# Altium schematic sheet XMOD_Frontpanel.SchDoc
size A4
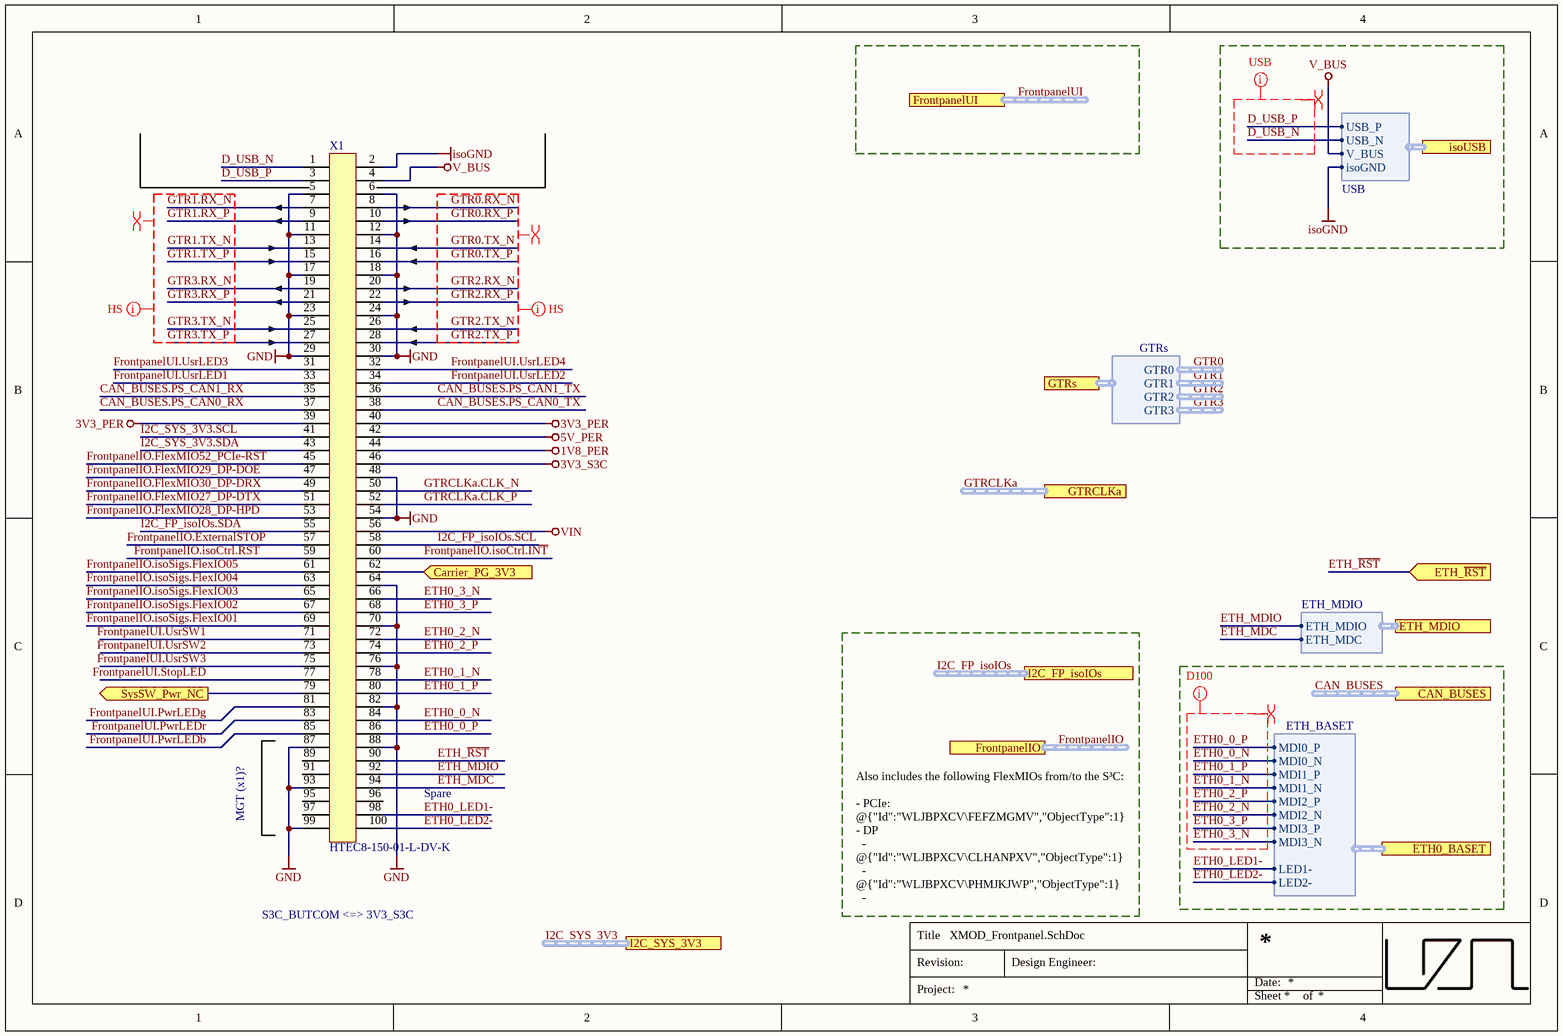
[diagram p0: XMOD_Frontpanel.SchDoc]

## Parts
X1  HTEC8-150-01-L-DV-K  [HTEC8-150-XX-X-DV]

## Ports
CAN_BUSES (harness CAN_BUSES), Carrier_PG_3V3 (in), ETH0_BASET (harness ETH_BASET), ETH_MDIO (harness ETH_MDIO), ETH_~{RST} (in), FrontpanelIO (harness FrontpanelIO), FrontpanelUI (harness FrontpanelUI), GTRCLKa (harness MGTCLK), GTRs (harness GTRs), I2C_FP_isoIOs (harness I2C), I2C_SYS_3V3 (harness I2C), isoUSB (harness USB), SysSW_Pwr_NC (out)

## Harnesses
GTRs: GTR0, GTR1, GTR2, GTR3
ETH_BASET: MDI0_P, MDI0_N, MDI1_P, MDI1_N, MDI2_P, MDI2_N, MDI3_P, MDI3_N, LED1-, LED2-
ETH_MDIO: ETH_MDC, ETH_MDIO
USB: USB_P, USB_N, V_BUS, isoGND

## Nets
1V8_PER: X1.44
3V3_PER: X1.39 X1.40
3V3_S3C: X1.46
5V_PER: X1.42
GND: X1.5 X1.6 X1.11 X1.12 X1.17 X1.18 X1.23 X1.24 X1.29 X1.30 X1.48 X1.54 X1.64 X1.70 X1.76 X1.82 X1.87 X1.88 X1.93 X1.99
isoGND: X1.2 ; port isoUSB.isoGND
V_BUS: X1.4 ; port isoUSB.V_BUS
VIN: X1.56
CAN_BUSES.PS_CAN0_RX: X1.37
CAN_BUSES.PS_CAN0_TX: X1.38
CAN_BUSES.PS_CAN1_RX: X1.35
CAN_BUSES.PS_CAN1_TX: X1.36
Carrier_PG_3V3: X1.62 ; port Carrier_PG_3V3
D_USB_N: X1.1 ; port isoUSB.USB_N
D_USB_P: X1.3 ; port isoUSB.USB_P
ETH0_0_N: X1.84 ; port ETH0_BASET.MDI0_N
ETH0_0_P: X1.86 ; port ETH0_BASET.MDI0_P
ETH0_1_N: X1.78 ; port ETH0_BASET.MDI1_N
ETH0_1_P: X1.80 ; port ETH0_BASET.MDI1_P
ETH0_2_N: X1.72 ; port ETH0_BASET.MDI2_N
ETH0_2_P: X1.74 ; port ETH0_BASET.MDI2_P
ETH0_3_N: X1.66 ; port ETH0_BASET.MDI3_N
ETH0_3_P: X1.68 ; port ETH0_BASET.MDI3_P
ETH0_LED1-: X1.98 ; port ETH0_BASET.LED1-
ETH0_LED2-: X1.100 ; port ETH0_BASET.LED2-
ETH_MDC: X1.94 ; port ETH_MDIO.ETH_MDC
ETH_MDIO: X1.92 ; port ETH_MDIO.ETH_MDIO
ETH_~{RST}: X1.90 ; port ETH_~{RST}
FrontpanelIO.ExternalSTOP: X1.57
FrontpanelIO.FlexMIO27_DP-DTX: X1.51
FrontpanelIO.FlexMIO28_DP-HPD: X1.53
FrontpanelIO.FlexMIO29_DP-DOE: X1.47
FrontpanelIO.FlexMIO30_DP-DRX: X1.49
FrontpanelIO.FlexMIO52_PCIe-~{RST}: X1.45
FrontpanelIO.isoCtrl.~{INT}: X1.60
FrontpanelIO.isoCtrl.~{RST}: X1.59
FrontpanelIO.isoSigs.FlexIO01: X1.69
FrontpanelIO.isoSigs.FlexIO02: X1.67
FrontpanelIO.isoSigs.FlexIO03: X1.65
FrontpanelIO.isoSigs.FlexIO04: X1.63
FrontpanelIO.isoSigs.FlexIO05: X1.61
FrontpanelUI.PwrLEDb: X1.85
FrontpanelUI.PwrLEDg: X1.81
FrontpanelUI.PwrLEDr: X1.83
FrontpanelUI.StopLED: X1.77
FrontpanelUI.UsrLED1: X1.33
FrontpanelUI.UsrLED2: X1.34
FrontpanelUI.UsrLED3: X1.31
FrontpanelUI.UsrLED4: X1.32
FrontpanelUI.UsrSW1: X1.71
FrontpanelUI.UsrSW2: X1.73
FrontpanelUI.UsrSW3: X1.75
GTR0.RX_N: X1.8
GTR0.RX_P: X1.10
GTR0.TX_N: X1.14
GTR0.TX_P: X1.16
GTR1.RX_N: X1.7
GTR1.RX_P: X1.9
GTR1.TX_N: X1.13
GTR1.TX_P: X1.15
GTR2.RX_N: X1.20
GTR2.RX_P: X1.22
GTR2.TX_N: X1.26
GTR2.TX_P: X1.28
GTR3.RX_N: X1.19
GTR3.RX_P: X1.21
GTR3.TX_N: X1.25
GTR3.TX_P: X1.27
GTRCLKa.CLK_N: X1.50
GTRCLKa.CLK_P: X1.52
I2C_FP_isoIOs.SCL: X1.58
I2C_FP_isoIOs.SDA: X1.55
I2C_SYS_3V3.SCL: X1.41
I2C_SYS_3V3.SDA: X1.43
SysSW_Pwr_NC: X1.79 ; port SysSW_Pwr_NC

Not connected (* = marked no-connect by the designer): X1 89 91 95 96 97

## Buses and harness runs
harness CAN_BUSES = port CAN_BUSES
harness FrontpanelIO = port FrontpanelIO
harness FrontpanelUI = port FrontpanelUI
harness GTRCLKa = port GTRCLKa
harness I2C_FP_isoIOs = port I2C_FP_isoIOs
harness I2C_SYS_3V3 = port I2C_SYS_3V3

## Layout directives
differential pair: D_USB_N, D_USB_P, ETH0_0_N, ETH0_0_P, ETH0_1_N, ETH0_1_P, ETH0_2_N, ETH0_2_P, ETH0_3_N, ETH0_3_P, GTR0.RX_N, GTR0.RX_P, GTR0.TX_N, GTR0.TX_P, GTR1.RX_N, GTR1.RX_P, GTR1.TX_N, GTR1.TX_P, GTR2.RX_N, GTR2.RX_P, GTR2.TX_N, GTR2.TX_P, GTR3.RX_N, GTR3.RX_P, GTR3.TX_N, GTR3.TX_P
net class HS: GTR0.RX_N, GTR0.RX_P, GTR0.TX_N, GTR0.TX_P, GTR1.RX_N, GTR1.RX_P, GTR1.TX_N, GTR1.TX_P, GTR2.RX_N, GTR2.RX_P, GTR2.TX_N, GTR2.TX_P, GTR3.RX_N, GTR3.RX_P, GTR3.TX_N, GTR3.TX_P
net class D100: ETH0_0_N, ETH0_0_P, ETH0_1_N, ETH0_1_P, ETH0_2_N, ETH0_2_P, ETH0_3_N, ETH0_3_P
net class USB: D_USB_N, D_USB_P

## Notes on the sheet
- MGT (x1)?
- Spare
- S3C_BUTCOM <=> 3V3_S3C
- Also includes the following FlexMIOs from/to the S³C:
  - PCIe: @{"Id":"WLJBPXCV\FEFZMGMV","ObjectType":1}
  - DP
  - @{"Id":"WLJBPXCV\CLHANPXV","ObjectType":1}
  - @{"Id":"WLJBPXCV\PHMJKJWP","ObjectType":1}
  - @{"Id":"WLJBPXCV\FIHKCZNR","ObjectType":1}
  - @{"Id":"WLJBPXCV\UFHDVYIT","ObjectType":1}
  Unused FlexMIOs can be used as (S³C/PS/PL-)GPIOs.
- Title
- Revision:
- Design Engineer:
- Date:
- Project:
- Sheet
- of

## Library data of the parts
X1 = HTEC8-150-01-L-DV-K: HTEC8-150-01-L-DV-K mating connector for card layout; Manufacturer: SAMTEC; Created from: MGremer; Number of positions: 100; Manufacturer Part Number: HTEC8-150-01-L-DV-K; PartID: 7; Created On: 26/02/2021 16:36:12; ComponentLink1Description: Homepage; ComponentLink1URL: https://www.samtec.com/de/products/htec8-150-01-l-dv; Component Type: Board to Board Connector; Device Package: SMD; Last Updated: 09/07/2024 10:19:13; Mounting Type: SMD; Series: HTEC; Supplier 1: SAMTEC; Supplier Part Number 1: HTEC8-150-01-L-DV-K; Type: Board to Board Connector; Live Cycle Status: 1; LCSC Part Number: C20365621; Stock number: not stored; Number of rows: 2